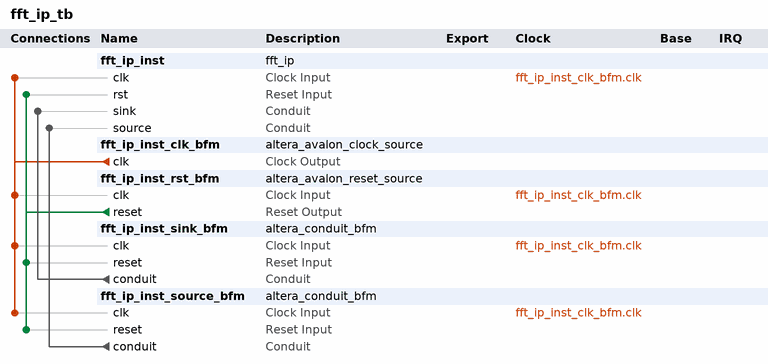
[diagram p0: system contents]
# Platform Designer (Qsys) system fft_ip_tb, Arria 10 10AS016C3U19E2LG
# Parameters at their usual value, and those the tool derives, are not listed.
package require -exact qsys 16.0
create_system fft_ip_tb
set_project_property DEVICE_FAMILY {Arria 10}
set_project_property DEVICE 10AS016C3U19E2LG

add_instance fft_ip_inst fft_ip 1.0

add_instance fft_ip_inst_clk_bfm altera_avalon_clock_source 16.0

add_instance fft_ip_inst_rst_bfm altera_avalon_reset_source 16.0
set_instance_parameter_value fft_ip_inst_rst_bfm ASSERT_HIGH_RESET 0
set_instance_parameter_value fft_ip_inst_rst_bfm INITIAL_RESET_CYCLES 50

add_instance fft_ip_inst_sink_bfm altera_conduit_bfm 16.0
set_instance_parameter_value fft_ip_inst_sink_bfm CLOCKED_SIGNAL true
set_instance_parameter_value fft_ip_inst_sink_bfm ENABLE_RESET true
set_instance_parameter_value fft_ip_inst_sink_bfm SIGNAL_DIRECTIONS output,input,output,output,output,output,output,output,output
set_instance_parameter_value fft_ip_inst_sink_bfm SIGNAL_ROLES sink_valid,sink_ready,sink_error,sink_sop,sink_eop,sink_real,sink_imag,fftpts_in,inverse
set_instance_parameter_value fft_ip_inst_sink_bfm SIGNAL_WIDTHS 1,1,2,1,1,32,32,19,1

add_instance fft_ip_inst_source_bfm altera_conduit_bfm 16.0
set_instance_parameter_value fft_ip_inst_source_bfm CLOCKED_SIGNAL true
set_instance_parameter_value fft_ip_inst_source_bfm ENABLE_RESET true
set_instance_parameter_value fft_ip_inst_source_bfm SIGNAL_DIRECTIONS input,output,input,input,input,input,input,input
set_instance_parameter_value fft_ip_inst_source_bfm SIGNAL_ROLES source_valid,source_ready,source_error,source_sop,source_eop,source_real,source_imag,fftpts_out
set_instance_parameter_value fft_ip_inst_source_bfm SIGNAL_WIDTHS 1,1,2,1,1,32,32,19

# connections
add_connection fft_ip_inst_clk_bfm.clk fft_ip_inst.clk clock
add_connection fft_ip_inst_clk_bfm.clk fft_ip_inst_rst_bfm.clk clock
add_connection fft_ip_inst_clk_bfm.clk fft_ip_inst_sink_bfm.clk clock
add_connection fft_ip_inst_clk_bfm.clk fft_ip_inst_source_bfm.clk clock
add_connection fft_ip_inst_rst_bfm.reset fft_ip_inst.rst reset
add_connection fft_ip_inst_rst_bfm.reset fft_ip_inst_sink_bfm.reset reset
add_connection fft_ip_inst_rst_bfm.reset fft_ip_inst_source_bfm.reset reset
add_connection fft_ip_inst_sink_bfm.conduit fft_ip_inst.sink conduit
add_connection fft_ip_inst_source_bfm.conduit fft_ip_inst.source conduit

set_interconnect_requirement {$system} qsys_mm.clockCrossingAdapter HANDSHAKE
set_interconnect_requirement {$system} qsys_mm.enableEccProtection FALSE
set_interconnect_requirement {$system} qsys_mm.insertDefaultSlave FALSE
set_interconnect_requirement {$system} qsys_mm.maxAdditionalLatency 1

save_system fft_ip_tb.qsys
